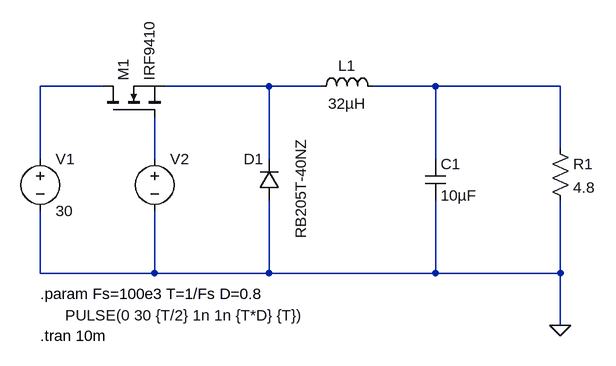
[diagram p0: schematic Draft2.asc]
Draft2.asc, the LTspice schematic file:
Version 4.1
SHEET 1 912 680
WIRE 144 16 48 16
WIRE 400 16 240 16
WIRE 480 16 400 16
WIRE 656 16 560 16
WIRE 848 16 656 16
WIRE 848 112 848 16
WIRE 48 128 48 16
WIRE 224 128 224 64
WIRE 400 128 400 16
WIRE 656 128 656 16
WIRE 48 304 48 208
WIRE 224 304 224 208
WIRE 224 304 48 304
WIRE 400 304 400 192
WIRE 400 304 224 304
WIRE 656 304 656 192
WIRE 656 304 400 304
WIRE 848 304 848 192
WIRE 848 304 656 304
WIRE 848 384 848 304
FLAG 848 384 0
SYMBOL voltage 48 112 R0
WINDOW 123 0 0 Left 0
WINDOW 39 0 0 Left 0
SYMATTR InstName V1
SYMATTR Value 30
SYMBOL diode 416 192 R180
WINDOW 0 24 64 Left 2
WINDOW 3 -33 -59 VRight 2
SYMATTR InstName D1
SYMATTR Value RB205T-40NZ
SYMATTR Description Diode
SYMATTR Type diode
SYMBOL ind 464 32 R270
WINDOW 0 32 56 VTop 2
WINDOW 3 5 56 VBottom 2
SYMATTR InstName L1
SYMATTR Value 32µH
SYMBOL cap 640 128 R0
SYMATTR InstName C1
SYMATTR Value 10µF
SYMBOL res 832 96 R0
SYMATTR InstName R1
SYMATTR Value 4.8
SYMBOL voltage 224 112 R0
WINDOW 3 -138 257 Left 2
WINDOW 123 0 0 Left 0
WINDOW 39 0 0 Left 0
SYMATTR InstName V2
SYMATTR Value PULSE(0 30 {T/2} 1n 1n {T*D} {T})
SYMBOL nmos 144 64 R270
SYMATTR InstName M1
SYMATTR Value IRF9410
TEXT 48 336 Left 2 !.param Fs=100e3 T=1/Fs D=0.8
TEXT 48 400 Left 2 !.tran 10m

The netlist it stands for:
* Draft2.asc
V1 N001 0 30
D1 0 N002 RB205T-40NZ
L1 N002 N003 32µH
C1 N003 0 10µF
R1 N003 0 4.8
V2 N004 0 PULSE(0 30 {T/2} 1n 1n {T*D} {T})
M1 N001 N004 N002 N002 IRF9410
.model D D
.lib standard.dio
.model NMOS NMOS
.model PMOS PMOS
.lib standard.mos
.param Fs=100e3 T=1/Fs D=0.8
.tran 10m
.backanno
.end